# Altium project ControlBoard.PrjPcb (part 5 of 8)

## Sheet ResistiveTempSensors.SchDoc: Title
size A4; SchTemplateVer: V2.0; Author: Adam Mizerkiewicz; CompanyName: Adam Mizerkiewicz; DrawnBy: Adam Mizerkiewicz; Engineer: Adam Mizerkiewicz; Organization: Adam Mizerkiewicz; Address1: Sarnia 2/19; Address2: 61-058 Poznań; Revision: 0.0; SheetNumber: 8; SheetTotal: 17
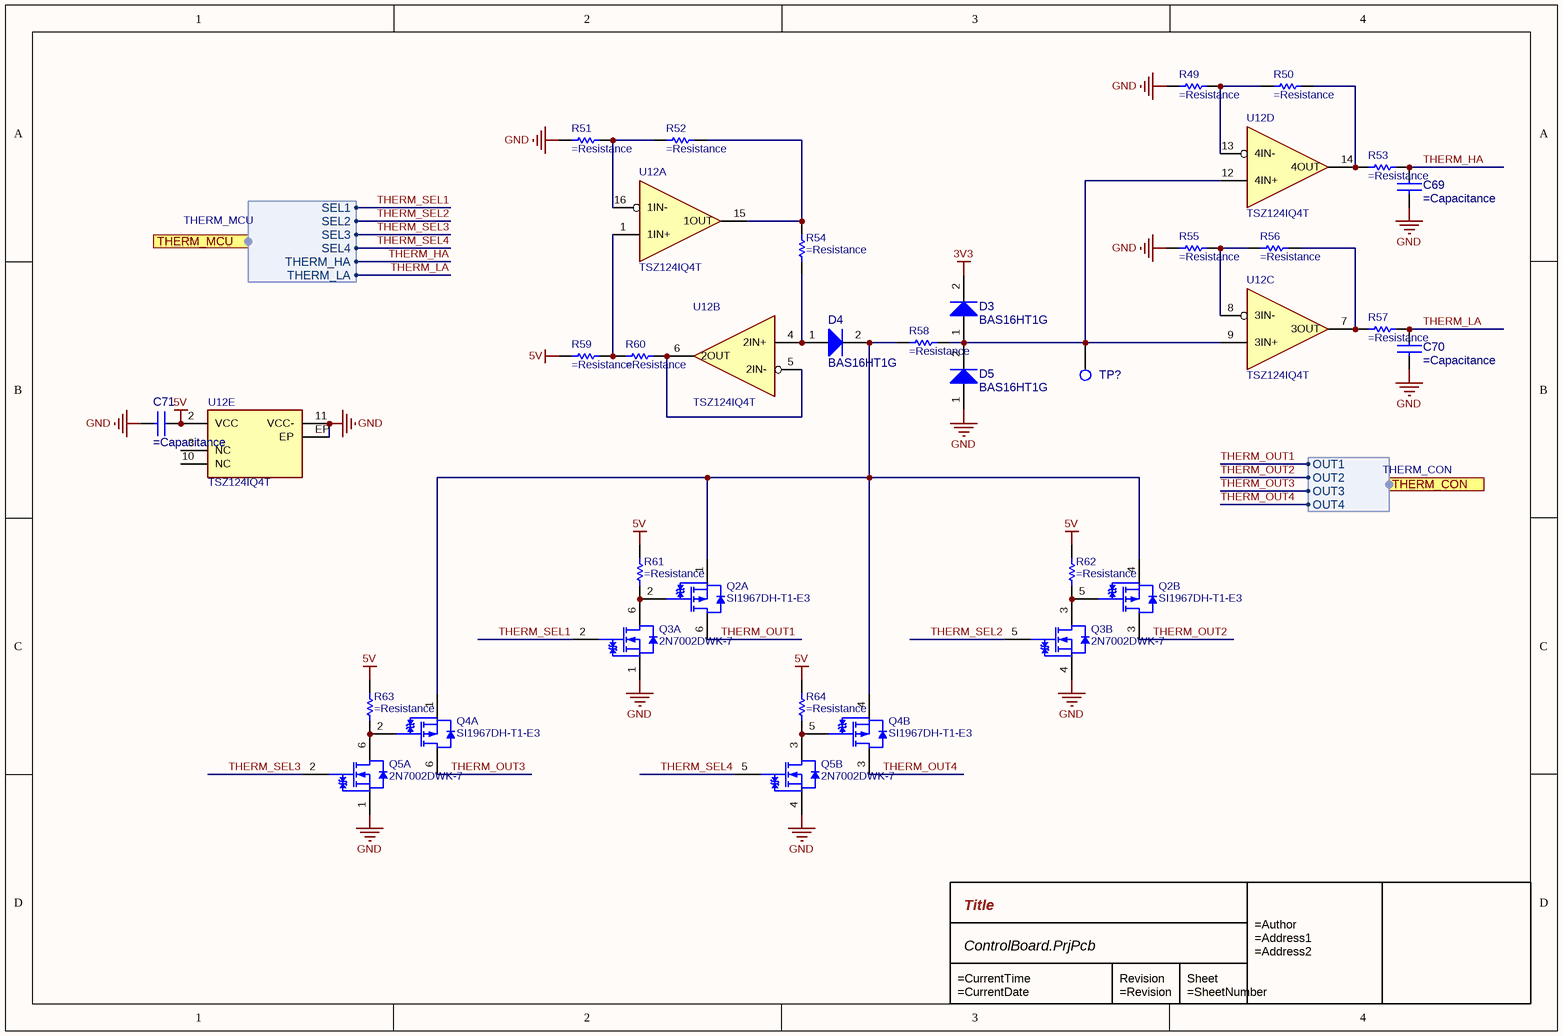
[diagram p12: ResistiveTempSensors.SchDoc]

### Parts
(Parts that share a designator on the sheet are numbered #1, #2 ... from top to bottom, then left to right.)
C69  (no value)  [C0402]
C70  (no value)  [C0402]
C71  (no value)  [C0402]
D3  BAS16HT1G  [SOD323]
D4  BAS16HT1G  [SOD323]
D5  BAS16HT1G  [SOD323]
Q2  SI1967DH-T1-E3  [SOT-363]  (parts A,B of 2)
Q3  2N7002DWK-7  [SOT-363]  (parts A,B of 2)
Q4  SI1967DH-T1-E3  [SOT-363]  (parts A,B of 2)
Q5  2N7002DWK-7  [SOT-363]  (parts A,B of 2)
R49  (no value)  [R0402]
R50  (no value)  [R0402]
R51  (no value)  [R0402]
R52  (no value)  [R0402]
R53  (no value)  [R0402]
R54  (no value)  [R0402]
R55  (no value)  [R0402]
R56  (no value)  [R0402]
R57  (no value)  [R0402]
R58  (no value)  [R0402]
R59  (no value)  [R0402]
R60  (no value)  [R0402]
R61  (no value)  [R0402]
R62  (no value)  [R0402]
R63  (no value)  [R0402]
R64  (no value)  [R0402]
TP?#7  TP_SMT  [TP_SMT]  (value not drawn)  (no BOM)
U12  TSZ124IQ4T  [VQFN16]  (parts A,B,C,D,E of 5)

### Ports
THERM_CON (harness THERM_CON), THERM_MCU (harness THERM_MCU)

### Harnesses
THERM_MCU: SEL1, SEL2, SEL3, SEL4, THERM_HA, THERM_LA
THERM_CON: OUT1, OUT2, OUT3, OUT4

### Nets
3V3: D3.2
5V: C71.1 R59.1 R61.2 R62.2 R63.2 R64.2 U12.2(VCC)
GND: C69.2 C70.2 C71.2 D5.1 Q3.1(S1) Q3.4(S2) Q5.1(S1) Q5.4(S2) R49.1 R51.1 R55.2 U12.11(VCC-) U12.EP
THERM_HA: C69.1 R53.1 ; port THERM_MCU.THERM_HA
THERM_LA: C70.1 R57.1 ; port THERM_MCU.THERM_LA
THERM_OUT1: Q2.6(D) ; port THERM_CON.OUT1
THERM_OUT2: Q2.3(D) ; port THERM_CON.OUT2
THERM_OUT3: Q4.6(D) ; port THERM_CON.OUT3
THERM_OUT4: Q4.3(D) ; port THERM_CON.OUT4
THERM_SEL1: Q3.2(G1) ; port THERM_MCU.SEL1
THERM_SEL2: Q3.5(G2) ; port THERM_MCU.SEL2
THERM_SEL3: Q5.2(G1) ; port THERM_MCU.SEL3
THERM_SEL4: Q5.5(G2) ; port THERM_MCU.SEL4
NetD3_1: D3.1 D5.2 R58.2 TP?#7.1 U12.9(3IN+) U12.12(4IN+)
NetD4_1: D4.1 R54.1 U12.4(2IN+)
NetD4_2: D4.2 Q2.1(S) Q2.4(S) Q4.1(S) Q4.4(S) R58.1
NetQ2_2: Q2.2(G) Q3.6(D1) R61.1
NetQ2_5: Q2.5(G) Q3.3(D2) R62.1
NetQ4_2: Q4.2(G) Q5.6(D1) R63.1
NetQ4_5: Q4.5(G) Q5.3(D2) R64.1
NetR49_2: R49.2 R50.2 U12.13(4IN-)
NetR50_1: R50.1 R53.2 U12.14(4OUT)
NetR51_2: R51.2 R52.1 U12.16(1IN-)
NetR52_2: R52.2 R54.2 U12.15(1OUT)
NetR55_1: R55.1 R56.2 U12.8(3IN-)
NetR56_1: R56.1 R57.2 U12.7(3OUT)
NetR59_2: R59.2 R60.1 U12.1(1IN+)
NetR60_2: R60.2 U12.5(2IN-) U12.6(2OUT)

Not connected (* = marked no-connect by the designer): U12 3(NC) 10(NC)

### Notes on the sheet
- Revision
  =Revision
- Sheet
  =SheetNumber / =SheetTotal

### Library data of the parts
C69-C71 = CAP0402-0.1uF-50V: CAP CER 0.1UF 50V X7R 0402; Manufacturer: Walsin Technologies; Manufacturer Part Number: 0402B104K500CT; Capacitance: 100nF; Material: 4241ConductorMaterial; Value: 100nF; Tolerance: 10%; Dielectric: 1511DielectricType; Supplier: Digikey; Supplier Part Number: 1292-1176-1-ND; RoHS: Yes; Category: Ceramic Capacitors; Stock: 109567; Pricing: 1=0,08, 10=0,005, 100=0,0032, 1000=0,0024 (USD); Mounting Technology: Surface Mount; Case/Package: 0402; Case Code (Imperial): 0402; Case Code (Metric): 1005; Min Operating Temperature: -55°C; Max Operating Temperature: 125°C; Packaging: Cut Tape; Voltage Rating: 50V; Series: -; Voltage Rating (DC): 50V; Height: 550um; RoHS Compliant: Yes; Lead Free: 5697LeadFree; ComponentLink1URL: http://datasheet.octopart.com/0402B104K500CT-Walsin-Technologies-datasheet-26371553.pdf?src-supplier=Arrow+Electronics; ComponentLink1Description: http://datasheet.octopart.com/0402B104K500CT-Walsin-Technologies-datasheet-26371553.pdf?src-supplier=Arrow+Electronics; ComponentLink2URL: http://datasheet.octopart.com/0402B104K500CT-Walsin-Technologies-datasheet-26371553.pdf?src-supplier=Verical; ComponentLink2Description: http://datasheet.octopart.com/0402B104K500CT-Walsin-Technologies-datasheet-26371553.pdf?src-supplier=Verical; ComponentLink3URL: http://www.passivecomponent.com/indexsea/0402B104K500CT-IE.pdf?src-supplier=Digikey; ComponentLink3Description: http://www.passivecomponent.com/indexsea/0402B104K500CT-IE.pdf?src-supplier=Digikey; ComponentLink4URL: http://datasheet.octopart.com/0402B104K500CT-Walsin-Technologies-datasheet-26371553.pdf?src-supplier=Rs; ComponentLink4Description: http://datasheet.octopart.com/0402B104K500CT-Walsin-Technologies-datasheet-26371553.pdf?src-supplier=Rs; ComponentLink5URL: https://datasheet.octopart.com/0402B104K500CT-Walsin-Technologies-datasheet-128065749.pdf?src-supplier=Future+Electronics; ComponentLink5Description: https://datasheet.octopart.com/0402B104K500CT-Walsin-Technologies-datasheet-128065749.pdf?src-supplier=Future+Electronics; ComponentLink6URL: http://datasheet.octopart.com/0402B104K500CT-Walsin-Technologies-datasheet-26371553.pdf?src-supplier=Farnell; ComponentLink6Description: http://datasheet.octopart.com/0402B104K500CT-Walsin-Technologies-datasheet-26371553.pdf?src-supplier=Farnell; ComponentLink7URL: http://datasheet.octopart.com/0402B104K500CT-Walsin-Technologies-datasheet-26371553.pdf?src-supplier=Newark; ComponentLink7Description: http://datasheet.octopart.com/0402B104K500CT-Walsin-Technologies-datasheet-26371553.pdf?src-supplier=Newark; ComponentLink8URL: http://datasheet.octopart.com/0402B104K500CT-Walsin-Technologies-datasheet-26371553.pdf?src-supplier=Mouser; ComponentLink8Description: http://datasheet.octopart.com/0402B104K500CT-Walsin-Technologies-datasheet-26371553.pdf?src-supplier=Mouser; ComponentLink9URL: http://datasheet.octopart.com/0402B104K500CT-Walsin-Technologies-datasheet-26371553.pdf?src-supplier=Digikey; ComponentLink9Description: http://datasheet.octopart.com/0402B104K500CT-Walsin-Technologies-datasheet-26371553.pdf?src-supplier=Digikey; ComponentLink10URL: https://datasheet.octopart.com/0402B104K500CT-Walsin-Technologies-datasheet-62066062.pdf?src-supplier=TME; ComponentLink10Description: https://datasheet.octopart.com/0402B104K500CT-Walsin-Technologies-datasheet-62066062.pdf?src-supplier=TME; ComponentLink11URL: http://datasheet.octopart.com/0402B104K500CT-Walsin-Technologies-datasheet-26371553.pdf?src-supplier=Freelance+Electronics; ComponentLink11Description: http://datasheet.octopart.com/0402B104K500CT-Walsin-Technologies-datasheet-26371553.pdf?src-supplier=Freelance+Electronics; ComponentLink12URL: http://datasheet.octopart.com/0402B104K500CT-Walsin-Technologies-datasheet-26371553.pdf?src-supplier=Component+Sense; ComponentLink12Description: http://datasheet.octopart.com/0402B104K500CT-Walsin-Technologies-datasheet-26371553.pdf?src-supplier=Component+Sense; ComponentLink13URL: http://datasheet.octopart.com/0402B104K500CT-Walsin-Technologies-datasheet-26371553.pdf?src-supplier=NAC+Semi; ComponentLink13Description: http://datasheet.octopart.com/0402B104K500CT-Walsin-Technologies-datasheet-26371553.pdf?src-supplier=NAC+Semi; ComponentLink14URL: https://datasheet.octopart.com/0402B104K500CT-Walsin-Technologies-datasheet-136037192.pdf?src-supplier=TECHDesign; ComponentLink14Description: https://datasheet.octopart.com/0402B104K500CT-Walsin-Technologies-datasheet-136037192.pdf?src-supplier=TECHDesign; Supplier 1: Digikey; Supplier Part Number 1: 1292-1176-1-ND
D3-D5 = BAS16H: Diode, Rectifier, Switching, Vr 75VDC, If 200MA, Pkg SOD-323, Vf 1250MV, Trr 6NS, Cj 2PF; Manufacturer: onsemi; Manufacturer Lifecycle Status: ACTIVE; Breakdown Voltage: 75V; Element Configuration: Single; Forward Voltage: 715mV; Max Forward Surge Current (Ifsm): 500mA; Max Power Dissipation: 200mW; Max Repetitive Reverse Voltage (Vrrm): 85V; Max Reverse Leakage Current: 1µA; Max Reverse Voltage (DC): 100V; Max Surge Current: 600mA; Number of Elements: 1; Polarity: Standard; Supplier 1: DigiKey; Supplier Part Number 1: BAS16HT1GOSCT-ND; Supplier: DigiKey; Supplier Part Number: BAS16HT1GOSCT-ND; Manufacturer Part Number: BAS16HT1G; RoHS: Compliant; Category: Rectifier Diodes; Stock: 518468; Pricing: 1=0,1, 10=0,049, 100=0,0422, 500=0,03042, 1000=0,02655 (USD); Average Rectified Current: 200mA; Value: 2pF; China RoHS: Compliant; Contact Plating: Tin; Current Rating: 200mA; Forward Current: 200mA; Height: 900µm; Lead Free: Lead Free; Length: 1.7mm; Lifecycle Status: Production; Max Operating Temperature: 150°C; Max Output current: 200mA; Min Operating Temperature: -55°C; Mounting Technology: Surface Mount; Pins: 2; Number of Terminals: 2; Output Current: 200mA; Packaging: Tape and Reel; Peak Non-Repetitive Surge Current: 600mA; Peak Reverse Current: 1µA; Power Dissipation: 200mW; Radiation Hardening: No; REACH SVHC: No; Recovery Time: 6ns; Reverse Recovery Time: 6ns; Reverse Standoff Voltage: 85V; Reverse Voltage: 85V; Schedule B: 8541100070, 8541100070|8541100070|8541100070|8541100070|8541100070; Voltage Rating (DC): 75V; Weight: 33mg; Width: 1.25mm; ComponentLink1URL: https://datasheet.octopart.com:443/BAS16HT1G-ON-Semiconductor-datasheet-115937.pdf?src-supplier=element14+APAC; ComponentLink1Description: https://datasheet.octopart.com:443/BAS16HT1G-ON-Semiconductor-datasheet-115937.pdf?src-supplier=element14+APAC; ComponentLink2URL: https://datasheet.octopart.com:443/BAS16HT1G-ON-Semiconductor-datasheet-67293425.pdf?src-supplier=element14+APAC; ComponentLink2Description: https://datasheet.octopart.com:443/BAS16HT1G-ON-Semiconductor-datasheet-67293425.pdf?src-supplier=element14+APAC; ComponentLink3URL: https://datasheet.octopart.com:443/BAS16HT1G-ON-Semiconductor-datasheet-86781274.pdf?src-supplier=element14+APAC; ComponentLink3Description: https://datasheet.octopart.com:443/BAS16HT1G-ON-Semiconductor-datasheet-86781274.pdf?src-supplier=element14+APAC; ComponentLink4URL: https://datasheet.octopart.com:443/BAS16HT1G-onsemi-datasheet-180957826.pdf?src-supplier=IHS; ComponentLink4Description: https://datasheet.octopart.com:443/BAS16HT1G-onsemi-datasheet-180957826.pdf?src-supplier=IHS; ComponentLink5URL: https://datasheet.octopart.com:443/BAS16HT1G-ON-Semiconductor-datasheet-30892817.pdf?src-supplier=IHS; ComponentLink5Description: https://datasheet.octopart.com:443/BAS16HT1G-ON-Semiconductor-datasheet-30892817.pdf?src-supplier=IHS; ComponentLink6URL: https://datasheet.octopart.com:443/BAS16HT1G-ON-Semiconductor-datasheet-33006779.pdf?src-supplier=Upverter; ComponentLink6Description: https://datasheet.octopart.com:443/BAS16HT1G-ON-Semiconductor-datasheet-33006779.pdf?src-supplier=Upverter; ComponentLink7URL: https://datasheet.octopart.com:443/BAS16HT1G-ON-Semiconductor-datasheet-137916682.pdf?src-supplier=onsemi; ComponentLink7Description: https://datasheet.octopart.com:443/BAS16HT1G-ON-Semiconductor-datasheet-137916682.pdf?src-supplier=onsemi; ComponentLink8URL: https://datasheet.octopart.com:443/BAS16HT1G-ON-Semiconductor-datasheet-86688369.pdf?src-supplier=onsemi; ComponentLink8Description: https://datasheet.octopart.com:443/BAS16HT1G-ON-Semiconductor-datasheet-86688369.pdf?src-supplier=onsemi; ComponentLink9URL: https://datasheet.octopart.com:443/BAS16HT1G-onsemi-datasheet-181958668.pdf?src-supplier=Newark; ComponentLink9Description: https://datasheet.octopart.com:443/BAS16HT1G-onsemi-datasheet-181958668.pdf?src-supplier=Newark; ComponentLink10URL: https://datasheet.octopart.com:443/BAS16HT1G-Fairchild-Semiconductor-datasheet-67878755.pdf?src-supplier=Newark; ComponentLink10Description: https://datasheet.octopart.com:443/BAS16HT1G-Fairchild-Semiconductor-datasheet-67878755.pdf?src-supplier=Newark; ComponentLink11URL: https://datasheet.octopart.com:443/BAS16HT1G-Fairchild-Semiconductor-datasheet-67809726.pdf?src-supplier=Newark; ComponentLink11Description: https://datasheet.octopart.com:443/BAS16HT1G-Fairchild-Semiconductor-datasheet-67809726.pdf?src-supplier=Newark; ComponentLink12URL: https://datasheet.octopart.com:443/BAS16HT1G-Fairchild-Semiconductor-datasheet-68558646.pdf?src-supplier=Newark; ComponentLink12Description: https://datasheet.octopart.com:443/BAS16HT1G-Fairchild-Semiconductor-datasheet-68558646.pdf?src-supplier=Newark; ComponentLink13URL: https://datasheet.octopart.com:443/BAS16HT1G-Fairchild-Semiconductor-datasheet-5362264.pdf?src-supplier=Fairchild+Semiconductor; ComponentLink13Description: https://datasheet.octopart.com:443/BAS16HT1G-Fairchild-Semiconductor-datasheet-5362264.pdf?src-supplier=Fairchild+Semiconductor; ComponentLink14URL: https://sigma.octopart.com:443/17344476/technical_drawing/Fairchild-Semiconductor-BAS16HT1G.pdf?src-supplier=Fairchild+Semiconductor; ComponentLink14Description: https://sigma.octopart.com:443/17344476/technical_drawing/Fairchild-Semiconductor-BAS16HT1G.pdf?src-supplier=Fairchild+Semiconductor; ComponentLink15URL: https://datasheet.octopart.com:443/BAS16HT1G-onsemi-datasheet-21771981.pdf?src-supplier=Master+Electronics; ComponentLink15Description: https://datasheet.octopart.com:443/BAS16HT1G-onsemi-datasheet-21771981.pdf?src-supplier=Master+Electronics; ComponentLink16URL: https://datasheet.octopart.com:443/BAS16HT1G-ON-Semiconductor-datasheet-17590349.pdf?src-supplier=TME; ComponentLink16Description: https://datasheet.octopart.com:443/BAS16HT1G-ON-Semiconductor-datasheet-17590349.pdf?src-supplier=TME; ComponentLink17URL: https://datasheet.octopart.com:443/BAS16HT1G-ON-Semiconductor-datasheet-14053657.pdf?src-supplier=iiiC; ComponentLink17Description: https://datasheet.octopart.com:443/BAS16HT1G-ON-Semiconductor-datasheet-14053657.pdf?src-supplier=iiiC; ComponentLink18URL: https://datasheet.octopart.com:443/BAS16HT1G-ON-Semiconductor-datasheet-9788525.pdf?src-supplier=RS+(Formerly+Allied+Electronics); ComponentLink18Description: https://datasheet.octopart.com:443/BAS16HT1G-ON-Semiconductor-datasheet-9788525.pdf?src-supplier=RS+(Formerly+Allied+Electronics); ComponentLink19URL: https://datasheet.octopart.com:443/BAS16HT1G-ON-Semiconductor-datasheet-8443271.pdf?src-supplier=Jameco; ComponentLink19Description: https://datasheet.octopart.com:443/BAS16HT1G-ON-Semiconductor-datasheet-8443271.pdf?src-supplier=Jameco; ComponentLink20URL: https://datasheet.octopart.com:443/BAS16HT1G-Fairchild-Semiconductor-datasheet-68652414.pdf?src-supplier=Farnell; ComponentLink20Description: https://datasheet.octopart.com:443/BAS16HT1G-Fairchild-Semiconductor-datasheet-68652414.pdf?src-supplier=Farnell; ComponentLink21URL: https://datasheet.octopart.com:443/BAS16HT1G-Fairchild-Semiconductor-datasheet-78857374.pdf?src-supplier=Farnell; ComponentLink21Description: https://datasheet.octopart.com:443/BAS16HT1G-Fairchild-Semiconductor-datasheet-78857374.pdf?src-supplier=Farnell; ComponentLink22URL: http://sigma.octopart.com:80/15540786/rohs_certificate/ON-Semiconductor-BAS16HT1G.pdf?src-supplier=Compliance+Statements; ComponentLink22Description: http://sigma.octopart.com:80/15540786/rohs_certificate/ON-Semiconductor-BAS16HT1G.pdf?src-supplier=Compliance+Statements; ComponentLink23URL: http://sigma.octopart.com:80/15674185/materials_sheet/ON-Semiconductor-BAS16HT1G.csv?src-supplier=Compliance+Statements; ComponentLink23Description: http://sigma.octopart.com:80/15674185/materials_sheet/ON-Semiconductor-BAS16HT1G.csv?src-supplier=Compliance+Statements; ComponentLink24URL: http://sigma.octopart.com:80/150603887/rohs_statement/ON-Semiconductor-BAS16HT1G.pdf?src-supplier=Compliance+Statements; ComponentLink24Description: http://sigma.octopart.com:80/150603887/rohs_statement/ON-Semiconductor-BAS16HT1G.pdf?src-supplier=Compliance+Statements; ComponentLink25URL: http://sigma.octopart.com:80/17344474/reach_statement/Fairchild-Semiconductor-BAS16HT1G.pdf?src-supplier=Compliance+Statements; ComponentLink25Description: http://sigma.octopart.com:80/17344474/reach_statement/Fairchild-Semiconductor-BAS16HT1G.pdf?src-supplier=Compliance+Statements; ComponentLink26URL: http://sigma.octopart.com:80/17344475/materials_sheet/Fairchild-Semiconductor-BAS16HT1G.pdf?src-supplier=Compliance+Statements; ComponentLink26Description: http://sigma.octopart.com:80/17344475/materials_sheet/Fairchild-Semiconductor-BAS16HT1G.pdf?src-supplier=Compliance+Statements; ComponentLink27URL: http://sigma.octopart.com:80/33049500/reach_statement/Fairchild-Semiconductor-BAS16HT1G.pdf?src-supplier=Compliance+Statements; ComponentLink27Description: http://sigma.octopart.com:80/33049500/reach_statement/Fairchild-Semiconductor-BAS16HT1G.pdf?src-supplier=Compliance+Statements; ComponentLink28URL: http://sigma.octopart.com:80/33049507/materials_sheet/Fairchild-Semiconductor-BAS16HT1G.pdf?src-supplier=Compliance+Statements; ComponentLink28Description: http://sigma.octopart.com:80/33049507/materials_sheet/Fairchild-Semiconductor-BAS16HT1G.pdf?src-supplier=Compliance+Statements; ComponentLink29URL: http://sigma.octopart.com:80/reach_statement/ON-Semiconductor-company-79.pdf?src-supplier=Compliance+Statements; ComponentLink29Description: http://sigma.octopart.com:80/reach_statement/ON-Semiconductor-company-79.pdf?src-supplier=Compliance+Statements; ComponentLink30URL: http://sigma.octopart.com:80/reach_statement/Fairchild-Semiconductor-company-9.pdf?src-supplier=Compliance+Statements; ComponentLink30Description: http://sigma.octopart.com:80/reach_statement/Fairchild-Semiconductor-company-9.pdf?src-supplier=Compliance+Statements; ComponentLink31URL: http://sigma.octopart.com:80/rohs_statement/Fairchild-Semiconductor-company-10.pdf?src-supplier=Compliance+Statements; ComponentLink31Description: http://sigma.octopart.com:80/rohs_statement/Fairchild-Semiconductor-company-10.pdf?src-supplier=Compliance+Statements; ComponentLink32URL: http://sigma.octopart.com:80/rohs_statement/Fairchild-Semiconductor-company-11.pdf?src-supplier=Compliance+Statements; ComponentLink32Description: http://sigma.octopart.com:80/rohs_statement/Fairchild-Semiconductor-company-11.pdf?src-supplier=Compliance+Statements; ComponentLink33URL: https://octopart.com:443/opatz8j6/c1?t=3sa6m3SxYoge9M9qGb4nmKLqBfrMfXhiJOp9hKZyxrh3ehL_BI6LOToHUMMaKyKket4Z1sj90yfHaTytxDd4kTrDgXQ_hpbHeYPETYjP_WAA8e26rBtBfn1_I3ReRiAJKkCOBeYfrSkepAVHT7WZ6faBb9xXyATk-AGWAiJUyc-olZRBf61e2PglA_o6oH6j0ZhWcjIMQr1OaZAsEemOypn9rSngJhyD2Q95BhY21uejmtdLxB3PfquCAALl-V8d6PzywhadjY_2sOYX1IRBN1ePsZlil2tKA3QQi1fpa_2NXZPSYNF3QM8W_-CjkL6rbjh6IOEZ1PtqSUWglJ_mpLUY0n0_jcKHQN0&src-supplier=Compliance+Statements; ComponentLink33Description: https://octopart.com:443/opatz8j6/c1?t=3sa6m3SxYoge9M9qGb4nmKLqBfrMfXhiJOp9hKZyxrh3ehL_BI6LOToHUMMaKyKket4Z1sj90yfHaTytxDd4kTrDgXQ_hpbHeYPETYjP_WAA8e26rBtBfn1_I3ReRiAJKkCOBeYfrSkepAVHT7WZ6faBb9xXyATk-AGWAiJUyc-olZRBf61e2PglA_o6oH6j0ZhWcjIMQr1OaZAsEemOypn9rSngJhyD2Q95BhY21uejmtdLxB3PfquCAALl-V8d6PzywhadjY_2sOYX1IRBN1ePsZlil2tKA3QQi1fpa_2NXZPSYNF3QM8W_-CjkL6rbjh6IOEZ1PtqSUWglJ_mpLUY0n0_jcKHQN0&src-supplier=Compliance+Statements; ComponentLink34URL: https://octopart.com:443/opatz8j6/c1?t=BeFj0GxZ0-VbTF2PfXHp6AnktMjJ4eXiHVy6Fo2zviSPGKYfBUukSRk8rDGnUJcdwRnP-ck7I8FMZezNYJ_1dK-dO54YBllHyBY0SnmYOKk1p3exRmhljXa6F2Bpgkcpr13sfMJDmDHTvXk40ahuM8IGb89TNn7vkLTl85aZ0H7gci15r64hfA7LHtbGW7rg3VX_V3sXUHsPHwOLj-ZkG6CcHSAMpHRU5QV5habCtdOmhiw0JT4yp_gLtU2Jo7wuRm4gw6v2ip48IG5kBRN8SehbmPIFgmt3ZxmeBnsXKDdBqXiqR7ew8NtlDUgnfFMGU43dhWEbA7nmL_UII0preXOLm51me80stQ&src-supplier=Compliance+Statements; ComponentLink34Description: https://octopart.com:443/opatz8j6/c1?t=BeFj0GxZ0-VbTF2PfXHp6AnktMjJ4eXiHVy6Fo2zviSPGKYfBUukSRk8rDGnUJcdwRnP-ck7I8FMZezNYJ_1dK-dO54YBllHyBY0SnmYOKk1p3exRmhljXa6F2Bpgkcpr13sfMJDmDHTvXk40ahuM8IGb89TNn7vkLTl85aZ0H7gci15r64hfA7LHtbGW7rg3VX_V3sXUHsPHwOLj-ZkG6CcHSAMpHRU5QV5habCtdOmhiw0JT4yp_gLtU2Jo7wuRm4gw6v2ip48IG5kBRN8SehbmPIFgmt3ZxmeBnsXKDdBqXiqR7ew8NtlDUgnfFMGU43dhWEbA7nmL_UII0preXOLm51me80stQ&src-supplier=Compliance+Statements
Q2 Q4 = SI1967DH-T1-E3: MOSFET 2P-CH 20V 1.3A SC70-6; Manufacturer: Vishay Siliconix; Rise Time: 27ns; Rds On Max: 490mR; Input Capacitance: 110pF; Gate to Source Voltage (Vgs): 8V; Max Power Dissipation: 1.25W; Turn-Off Delay Time: 15ns; Turn-On Delay Time: 12ns; Number of Channels: 2; Polarity: P-CHANNEL; Supplier 1: Digikey; Supplier Part Number 1: SI1967DH-T1-E3CT-ND; Supplier: Digikey; Supplier Part Number: SI1967DH-T1-E3CT-ND; Manufacturer Part Number: SI1967DH-T1-E3; RoHS: No; Category: MOSFETs; Stock: 6717; Pricing: 1=0,66, 10=0,409, 100=0,2622, 500=0,19876, 1000=0,16922 (USD); Mounting Technology: Surface Mount; Weight: 0.000988oz; Min Operating Temperature: -55°C; Max Operating Temperature: 150°C; Packaging: Tape and Reel; Package Quantity: 3000; Continuous Drain Current (ID): 1.3A; Drain to Source Resistance: 490mR; Fall Time: 27ns; Drain to Source Voltage (Vdss): 20V; Series: TrenchFET®; Length: 2mm; Width: 1.25mm; Height: 1mm; Radiation Hardening: No; Lead Free: Lead Free; RoHS Compliant: Yes; ComponentLink1URL: https://datasheet.ciiva.com/930/si1967dh-930084.pdf?src-supplier=Digikey; ComponentLink1Description: https://datasheet.ciiva.com/930/si1967dh-930084.pdf?src-supplier=Digikey; ComponentLink2URL: https://datasheet.ciiva.com/11161/si1967dh-11161099.pdf?src-supplier=Avnet; ComponentLink2Description: https://datasheet.ciiva.com/11161/si1967dh-11161099.pdf?src-supplier=Avnet
Q3 Q5 = 2N7002DWK-7: MOSFET 2N-CH 60V 0.261A SOT363; Manufacturer: Diodes; Supplier: Digikey; Supplier Part Number: 31-2N7002DWK-7CT-ND; Manufacturer Part Number: 2N7002DWK-7; RoHS: No; Category: Uncategorized; Stock: 2664; Pricing: 1=0,21, 10=0,142, 100=0,0931, 500=0,07452, 1000=0,06584 (USD); Supplier 1: Digikey; Supplier Part Number 1: 31-2N7002DWK-7CT-ND
R49 = RES0402-1k-1%: Res Thick Film 0402 1K Ohm 1% 0.063W(1/16W) ±50ppm/C Pad SMD Automotive T/R; Manufacturer: Vishay; Manufacturer Part Number: CRCW04021K00FHEDP; Resistance: 1kΩ; Max Power Dissipation: 63mW; Value: 1kΩ; Temperature Coefficient: 50ppm/°C; Voltage Rating: 50V; Supplier 1: DigiKey; Supplier Part Number 1: CRCW04021K00FHEDP-ND; Supplier: DigiKey; Supplier Part Number: CRCW04021K00FHEDP-ND; RoHS: Compliant; Category: Chip SMD Resistors; Pricing: 10000=0,03252 (USD); Case/Package: 0402; China RoHS: Non-Compliant; Composition: Thick Film; Contact Plating: Tin; Depth: 500µm; Features: Automotive AEC-Q200; Height: 350µm; Length: 990.6µm; Lifecycle Status: Production; Max Operating Temperature: 155°C; Military Standard: Not; Min Operating Temperature: -55°C; Mounting Technology: Surface Mount; Number of Terminals: 2; Number of Terminations: 2; Packaging: Tape & Reel; Power Dissipation: 63mW; Power Rating: 63mW; Radiation Hardening: No; REACH SVHC: Yes; Tolerance: 1%; Width: 500µm; Working Voltage: 50V; ComponentLink1URL: https://datasheet.octopart.com:443/CRCW04021K00FHEDP-Vishay-datasheet-182027415.pdf?src-supplier=IHS; ComponentLink1Description: https://datasheet.octopart.com:443/CRCW04021K00FHEDP-Vishay-datasheet-182027415.pdf?src-supplier=IHS; ComponentLink2URL: https://datasheet.octopart.com:443/CRCW04021K00FHEDP-Vishay-Dale-datasheet-141207190.pdf?src-supplier=Upverter; ComponentLink2Description: https://datasheet.octopart.com:443/CRCW04021K00FHEDP-Vishay-Dale-datasheet-141207190.pdf?src-supplier=Upverter; ComponentLink3URL: http://sigma.octopart.com:80/rohs_statement/Vishay-company-15.pdf?src-supplier=Compliance+Statements; ComponentLink3Description: http://sigma.octopart.com:80/rohs_statement/Vishay-company-15.pdf?src-supplier=Compliance+Statements
R50 R52-R57 R60-R64 = RES0402-10k-1%: Res Thick Film 0402 10K Ohm 1% 0.063W(1/16W) ±100ppm/C Pad SMD T/R Automotive AEC-Q200; Manufacturer: Vishay; Manufacturer Part Number: CRCW040210K0FKEE; Resistance: 10kΩ; Max Power Dissipation: 63mW; Value: 10kΩ; Temperature Coefficient: 100ppm/°C; Voltage Rating: 50V; Supplier 1: DigiKey; Supplier Part Number 1: 541-2954-1-ND; Supplier: DigiKey; Supplier Part Number: 541-2954-1-ND; RoHS: Compliant; Category: Chip SMD Resistors; Pricing: 1=0,1, 10=0,03, 25=0,0224, 50=0,018, 100=0,0148, 250=0,01156, 500=0,00974, 1000=0,00832, 5000=0,00637 (USD); Case/Package: 0402; Case Code (Imperial): 0402; Case Code (Metric): 1005; China RoHS: Non-Compliant; Composition: Thick Film; Contact Plating: Tin; Depth: 500µm; Features: Automotive AEC-Q200; Height: 350µm; Lead Free: Lead Free; Length: 990.6µm; Lifecycle Status: Production; Max Operating Temperature: 155°C; Military Standard: Not; Min Operating Temperature: -55°C; Mounting Technology: Surface Mount; Number of Terminals: 2; Number of Terminations: 2; Packaging: Tape & Reel; Power Dissipation: 63mW; Power Rating: 63mW; Radiation Hardening: No; REACH SVHC: Yes; Schedule B: 8533210045, 8533210045|8533210045|8533210045|8533210045|8533210045|8533210045|8533210045|8533210045|8533210045|8533210045|8533210045|8533210045|8533210045|8533210045|8533210045|8533210045|8533210045|8533210045|8533210045|8533210045|8533210045|8533210045|8533210045|85; Tolerance: 1%; Voltage Rating (DC): 50V; Width: 500µm; Working Voltage: 50V; ComponentLink1URL: https://datasheet.octopart.com:443/CRCW040210K0FKEE-Vishay-datasheet-175423584.pdf?src-supplier=IHS; ComponentLink1Description: https://datasheet.octopart.com:443/CRCW040210K0FKEE-Vishay-datasheet-175423584.pdf?src-supplier=IHS; ComponentLink2URL: https://datasheet.octopart.com:443/CRCW040210K0FKEE-Vishay-datasheet-62316122.pdf?src-supplier=Future+Electronics; ComponentLink2Description: https://datasheet.octopart.com:443/CRCW040210K0FKEE-Vishay-datasheet-62316122.pdf?src-supplier=Future+Electronics; ComponentLink3URL: http://sigma.octopart.com:80/rohs_statement/Vishay-company-15.pdf?src-supplier=Compliance+Statements; ComponentLink3Description: http://sigma.octopart.com:80/rohs_statement/Vishay-company-15.pdf?src-supplier=Compliance+Statements
R51 R59 = RES0402-2k-1%: Res Thick Film 0402 2K Ohm 1% 1/16W 100ppm/C Molded SMD SMD Paper T/R; Manufacturer: Vishay; Manufacturer Part Number: CRCW04022K00FKEE; Resistance: 2kΩ; Max Power Dissipation: 63mW; Value: 2kΩ; Temperature Coefficient: 100ppm/°C; Voltage Rating: 50V; Supplier 1: DigiKey; Supplier Part Number 1: 541-CRCW04022K00FKEECT-ND; Supplier: DigiKey; Supplier Part Number: 541-CRCW04022K00FKEECT-ND; RoHS: Compliant; Category: Chip SMD Resistors; Stock: 10445; Pricing: 1=0,1, 10=0,03, 25=0,0224, 50=0,018, 100=0,0148, 250=0,01156, 500=0,01056, 1000=0,0084, 5000=0,00637 (USD); Case/Package: 0402; China RoHS: Non-Compliant; Composition: Thick Film; Contact Plating: Tin; Features: Automotive AEC-Q200; Height: 350µm; Lead Free: Lead Free; Length: 990.6µm; Lifecycle Status: Production; Max Operating Temperature: 155°C; Min Operating Temperature: -55°C; Mounting Technology: Surface Mount; Number of Terminals: 2; Number of Terminations: 2; Packaging: Tape & Reel; Power Dissipation: 63mW; Power Rating: 63mW; Radiation Hardening: No; REACH SVHC: Yes; Tolerance: 1%; Width: 500µm; Working Voltage: 50V; ComponentLink1URL: https://datasheet.octopart.com:443/CRCW04022K00FKEE-Vishay-datasheet-175423584.pdf?src-supplier=IHS; ComponentLink1Description: https://datasheet.octopart.com:443/CRCW04022K00FKEE-Vishay-datasheet-175423584.pdf?src-supplier=IHS; ComponentLink2URL: https://datasheet.octopart.com/D-CRCW-e3-Standard-Thick-Film-Chip-Resistors-Vishay-datasheet-family-64.pdf; ComponentLink2Description: https://datasheet.octopart.com/D-CRCW-e3-Standard-Thick-Film-Chip-Resistors-Vishay-datasheet-family-64.pdf; ComponentLink3URL: http://sigma.octopart.com:80/rohs_certificate/D-CRCW-e3-Standard-Thick-Film-Chip-Resistors-Vishay-family-102.pdf?src-supplier=Compliance+Statements; ComponentLink3Description: http://sigma.octopart.com:80/rohs_certificate/D-CRCW-e3-Standard-Thick-Film-Chip-Resistors-Vishay-family-102.pdf?src-supplier=Compliance+Statements
R58 = RES0402-100k-1%: Res Thick Film 0402 100K Ohm 1% 0.063W(1/16W) ±100ppm/C Molded SMD Automotive Paper T/R; Manufacturer: Vishay; Manufacturer Part Number: CRCW0402100KFKEE; Resistance: 100kΩ; Max Power Dissipation: 63mW; Value: 100kΩ; Temperature Coefficient: 100ppm/°C; Voltage Rating: 50V; Supplier 1: DigiKey; Supplier Part Number 1: 541-CRCW0402100KFKEECT-ND; Supplier: DigiKey; Supplier Part Number: 541-CRCW0402100KFKEECT-ND; RoHS: Compliant; Category: Chip SMD Resistors; Stock: 14497; Pricing: 1=0,1, 10=0,03, 25=0,0224, 50=0,018, 100=0,0148, 250=0,01156, 500=0,00974, 1000=0,00832, 5000=0,00606 (USD); Case/Package: 0402; China RoHS: Non-Compliant; Composition: Thick Film; Contact Plating: Tin; Depth: 500µm; Features: Automotive AEC-Q200; Height: 350µm; Lead Free: Lead Free; Length: 990.6µm; Lifecycle Status: Production; Max Operating Temperature: 155°C; Military Standard: Not; Min Operating Temperature: -55°C; Mounting Technology: Surface Mount; Number of Terminals: 2; Number of Terminations: 2; Packaging: Tape & Reel; Power Dissipation: 63mW; Power Rating: 63mW; Radiation Hardening: No; REACH SVHC: Yes; Schedule B: 8533210045, 8533210045|8533210045|8533210045|8533210045|8533210045|8533210045|8533210045|8533210045|8533210045|8533210045|8533210045|8533210045|8533210045|8533210045|8533210045|8533210045|8533210045|8533210045|8533210045|8533210045|8533210045|8533210045|8533210045|85; Tolerance: 1%; Voltage Rating (DC): 50V; Width: 500µm; Working Voltage: 50V; ComponentLink1URL: https://datasheet.octopart.com:443/CRCW0402100KFKEE-Vishay-datasheet-175423584.pdf?src-supplier=IHS; ComponentLink1Description: https://datasheet.octopart.com:443/CRCW0402100KFKEE-Vishay-datasheet-175423584.pdf?src-supplier=IHS; ComponentLink2URL: https://datasheet.octopart.com:443/CRCW0402100KFKEE-Vishay-datasheet-190005712.pdf?src-supplier=TME; ComponentLink2Description: https://datasheet.octopart.com:443/CRCW0402100KFKEE-Vishay-datasheet-190005712.pdf?src-supplier=TME; ComponentLink3URL: https://datasheet.octopart.com:443/CRCW0402100KFKEE-Vishay-datasheet-62316122.pdf?src-supplier=Future+Electronics; ComponentLink3Description: https://datasheet.octopart.com:443/CRCW0402100KFKEE-Vishay-datasheet-62316122.pdf?src-supplier=Future+Electronics; ComponentLink4URL: https://datasheet.octopart.com/D-CRCW-e3-Standard-Thick-Film-Chip-Resistors-Vishay-datasheet-family-64.pdf; ComponentLink4Description: https://datasheet.octopart.com/D-CRCW-e3-Standard-Thick-Film-Chip-Resistors-Vishay-datasheet-family-64.pdf; ComponentLink5URL: http://sigma.octopart.com:80/rohs_certificate/D-CRCW-e3-Standard-Thick-Film-Chip-Resistors-Vishay-family-102.pdf?src-supplier=Compliance+Statements; ComponentLink5Description: http://sigma.octopart.com:80/rohs_certificate/D-CRCW-e3-Standard-Thick-Film-Chip-Resistors-Vishay-family-102.pdf?src-supplier=Compliance+Statements
TP?#7 = TP: TEST POINT
U12 = TSZ124IQ4T: TSZ124 Series 5.5V 400 kHz Rail to Rail SMT Operational Amplifier - TSSOP-14; Manufacturer: STMicroelectronics; Bandwidth: 400kHz; Common Mode Rejection Ratio: 115dB; Input Bias Current: 200pA; Input Offset Voltage (Vos): 8µV; Max Supply Current: 40µA; Max Supply Voltage: 6V; Min Supply Voltage: 1.8V; Nominal Supply Current: 31µA; Number of Channels: 4; Operating Supply Voltage: 3.3V; Output Current: 17mA; Output Current per Channel: 18mA; Slew Rate: 0.19V/µs; Voltage Gain: 135dB; Supplier 1: DigiKey; Supplier Part Number 1: 497-14337-1-ND; Supplier: DigiKey; Supplier Part Number: 497-14337-1-ND; Manufacturer Part Number: TSZ124IQ4T; RoHS: Compliant; Category: Amplifiers - Op Amps, Buffer, Instrumentation; Stock: 10565; Pricing: 1=1,86, 10=1,367, 25=1,2444, 100=1,1092, 250=1,0448, 500=1,00596, 1000=0,97398 (USD); Case/Package: QFN; China RoHS: Compliant; Gain Bandwidth Product: 400kHz; Height - Seated (Max): 1mm; Length: 3mm; Lifecycle Status: Production; Max Operating Temperature: 125°C; Min Operating Temperature: -40°C; Mounting Technology: Surface Mount; Number of Circuits: 4; Pins: 16; Number of Terminals: 4; Operating Supply Current: 31µA; Packaging: Tape and Reel; REACH SVHC: Yes; Schedule B: 8542330000, 8542330000|8542330000|8542330000|8542330000|8542330000; Terminal Pitch: 500µm; Unity Gain Bandwidth Product: 400kHz; Width: 3mm; ComponentLink1URL: https://datasheet.octopart.com:443/TSZ124IQ4T-STMicroelectronics-datasheet-62337710.pdf?src-supplier=Future+Electronics; ComponentLink1Description: https://datasheet.octopart.com:443/TSZ124IQ4T-STMicroelectronics-datasheet-62337710.pdf?src-supplier=Future+Electronics; ComponentLink2URL: https://datasheet.octopart.com:443/TSZ124IQ4T-STMicroelectronics-datasheet-16350222.pdf?src-supplier=STMicroelectronics; ComponentLink2Description: https://datasheet.octopart.com:443/TSZ124IQ4T-STMicroelectronics-datasheet-16350222.pdf?src-supplier=STMicroelectronics; ComponentLink3URL: https://datasheet.octopart.com:443/TSZ124IQ4T-STMicroelectronics-datasheet-140259870.pdf?src-supplier=Farnell; ComponentLink3Description: https://datasheet.octopart.com:443/TSZ124IQ4T-STMicroelectronics-datasheet-140259870.pdf?src-supplier=Farnell; ComponentLink4URL: https://datasheet.octopart.com:443/TSZ124IQ4T-STMicroelectronics-datasheet-159009515.pdf?src-supplier=SHENGYU+ELECTRONICS; ComponentLink4Description: https://datasheet.octopart.com:443/TSZ124IQ4T-STMicroelectronics-datasheet-159009515.pdf?src-supplier=SHENGYU+ELECTRONICS; ComponentLink5URL: https://datasheet.octopart.com:443/TSZ124IQ4T-STMicroelectronics-datasheet-165583692.pdf?src-supplier=TME; ComponentLink5Description: https://datasheet.octopart.com:443/TSZ124IQ4T-STMicroelectronics-datasheet-165583692.pdf?src-supplier=TME

## Sheet Supply.SchDoc: Title
size A4; Author: Adam Mizerkiewicz; CompanyName: Adam Mizerkiewicz; DrawnBy: Adam Mizerkiewicz; Engineer: Adam Mizerkiewicz; Organization: Adam Mizerkiewicz; Address1: Sarnia 2/19; Address2: 61-058 Poznań; Revision: 0.0; SheetNumber: 3; SheetTotal: 17
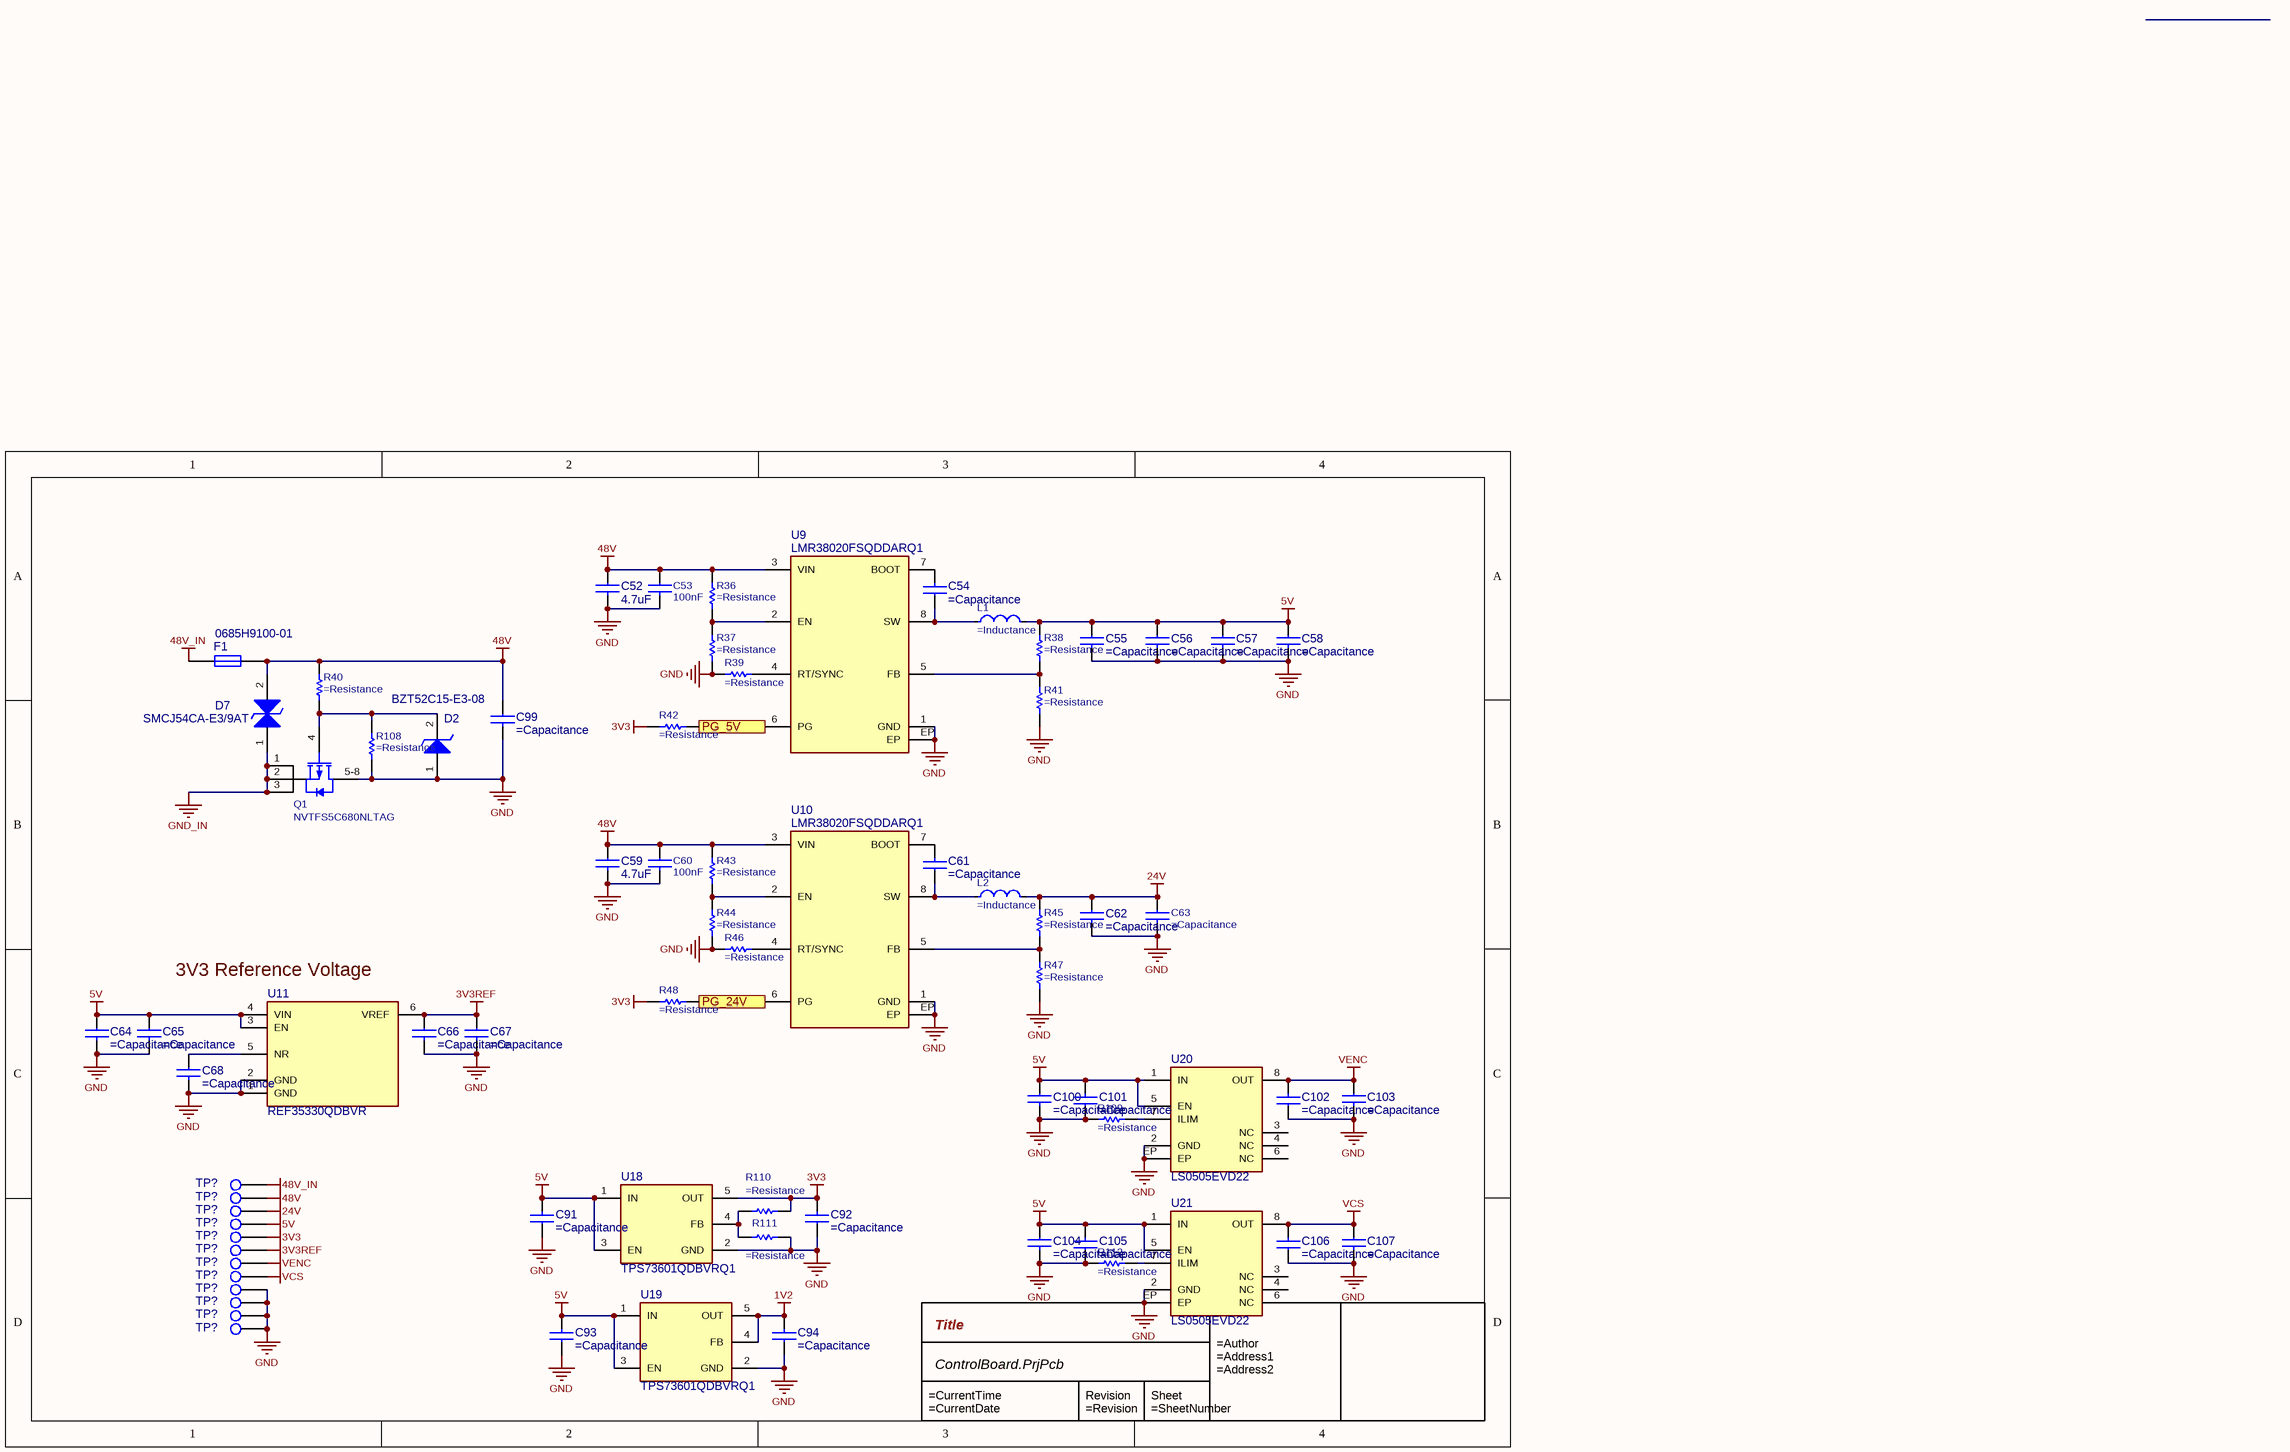
[diagram p13: Supply.SchDoc]

### Parts
(Parts that share a designator on the sheet are numbered #1, #2 ... from top to bottom, then left to right.)
C52  4.7uF  [C1206]
C53  100nF  [C0603]
C54  (no value)  [C0402]
C55  (no value)  [C0402]
C56  (no value)  [C0402]
C57  (no value)  [C0402]
C58  (no value)  [C0402]
C59  4.7uF  [C1206]
C60  100nF  [C0603]
C61  (no value)  [C0402]
C62  (no value)  [C0402]
C63  (no value)  [C0805]
C64  (no value)  [C0402]
C65  (no value)  [C0402]
C66  (no value)  [C0402]
C67  (no value)  [C0402]
C68  (no value)  [C0402]
C91  (no value)  [C0402]
C92  (no value)  [C0402]
C93  (no value)  [C0402]
C94  (no value)  [C0402]
C99  (no value)  [C1206]
C100  (no value)  [C0402]
C101  (no value)  [C0402]
C102  (no value)  [C0402]
C103  (no value)  [C0402]
C104  (no value)  [C0402]
C105  (no value)  [C0402]
C106  (no value)  [C0402]
C107  (no value)  [C0402]
D2  BZT52C15-E3-08  [SOD-123]
D7  SMCJ54CA-E3/9AT  [SMCJ_UNIPOLAR]
F1  0685H9100-01  [FUSE1206]
L1  (no value)  [ETQP4MxxxYFP]
L2  (no value)  [ETQP5MxxxYFM]
Q1  NVTFS5C680NLTAG  [WDFN8]
R36  (no value)  [R0402]
R37  (no value)  [R0402]
R38  (no value)  [R0402]
R39  (no value)  [R0402]
R40  (no value)  [R0402]
R41  (no value)  [R0402]
R42  (no value)  [R0402]
R43  (no value)  [R0402]
R44  (no value)  [R0402]
R45  (no value)  [R0402]
R46  (no value)  [R0402]
R47  (no value)  [R0402]
R48  (no value)  [R0402]
R108  (no value)  [R0402]
R109  (no value)  [R0402]
R110  (no value)  [R0402]
R111  (no value)  [R0402]
R112  (no value)  [R0402]
TP?#8  TP_SMT  [TP_SMT]  (value not drawn)  (no BOM)
TP?#9  TP_SMT  [TP_SMT]  (value not drawn)  (no BOM)
TP?#10  TP_SMT  [TP_SMT]  (value not drawn)  (no BOM)
TP?#11  TP_SMT  [TP_SMT]  (value not drawn)  (no BOM)
TP?#12  TP_SMT  [TP_SMT]  (value not drawn)  (no BOM)
TP?#13  TP_SMT  [TP_SMT]  (value not drawn)  (no BOM)
TP?#14  TP_SMT  [TP_SMT]  (value not drawn)  (no BOM)
TP?#15  TP_SMT  [TP_SMT]  (value not drawn)  (no BOM)
TP?#16  TP_SMT  [TP_SMT]  (value not drawn)  (no BOM)
TP?#17  TP_SMT  [TP_SMT]  (value not drawn)  (no BOM)
TP?#18  TP_SMT  [TP_SMT]  (value not drawn)  (no BOM)
TP?#19  TP_SMT  [TP_SMT]  (value not drawn)  (no BOM)
U9  LMR38020FSQDDARQ1  [SOIC8_PAD]
U10  LMR38020FSQDDARQ1  [SOIC8_PAD]
U11  REF35330QDBVR  [SOT-23-6]
U18  TPS73601QDBVRQ1  [SOT-23-5]
U19  TPS73601QDBVRQ1  [SOT-23-5]
U20  LS0505EVD22  [DFN2x2_8L]
U21  LS0505EVD22  [DFN2x2_8L]

### Ports
PG_5V (out), PG_24V (out)

### Nets
1V2: C94.2 U19.4(FB) U19.5(OUT)
3V3: C92.2 R42.2 R48.2 R110.2 TP?#12.1 U18.5(OUT)
3V3REF: C66.1 C67.1 TP?#13.1 U11.6(VREF)
5V: C55.1 C56.1 C57.1 C58.1 C64.1 C65.1 C91.2 C93.2 C100.1 C101.2 C104.1 C105.2 L1.2 R38.2 TP?#11.1 U11.3(EN) U11.4(VIN) U18.1(IN) U18.3(EN) U19.1(IN) U19.3(EN) U20.1(IN) U20.5(EN) U21.1(IN) U21.5(EN)
24V: C62.1 C63.1 L2.2 R45.2 TP?#10.1
48V: C52.1 C53.1 C59.1 C60.1 C99.1 D7.2 F1.1 R36.2 R40.2 R43.2 TP?#9.1 U9.3(VIN) U10.3(VIN)
48V_IN: F1.2 TP?#8.1
GND: C52.2 C53.2 C55.2 C56.2 C57.2 C58.2 C59.2 C60.2 C62.2 C63.2 C64.2 C65.2 C66.2 C67.2 C68.2 C91.1 C92.1 C93.1 C94.1 C99.2 C100.2 C101.1 C102.1 C103.2 C104.2 C105.1 C106.1 C107.2 D2.1 Q1.5-8(D) R37.1 R39.1 R41.1 R44.1 R46.1 R47.1 R108.1 R109.1 R111.2 R112.1 TP?#16.1 TP?#17.1 TP?#18.1 TP?#19.1 U9.1(GND) U9.EP U10.1(GND) U10.EP U11.1(GND) U11.2(GND) U18.2(GND) U19.2(GND) U20.2(GND) U20.EP U21.2(GND) U21.EP
GND_IN: D7.1 Q1.1(S) Q1.2(S) Q1.3(S)
VCS: C106.2 C107.1 TP?#15.1 U21.8(OUT)
VENC: C102.2 C103.1 TP?#14.1 U20.8(OUT)
PG_24V: R48.1 U10.6(PG) ; port PG_24V
PG_ 5V: R42.1 U9.6(PG) ; port PG_5V
NetC54_1: C54.1 L1.1 U9.8(SW)
NetC54_2: C54.2 U9.7(BOOT)
NetC61_1: C61.1 L2.1 U10.8(SW)
NetC61_2: C61.2 U10.7(BOOT)
NetC68_1: C68.1 U11.5(NR)
NetD2_2: D2.2 Q1.4(G) R40.1 R108.2
NetR36_1: R36.1 R37.2 U9.2(EN)
NetR38_1: R38.1 R41.2 U9.5(FB)
NetR39_2: R39.2 U9.4(RT/SYNC)
NetR43_1: R43.1 R44.2 U10.2(EN)
NetR45_1: R45.1 R47.2 U10.5(FB)
NetR46_2: R46.2 U10.4(RT/SYNC)
NetR109_2: R109.2 U20.7(ILIM)
NetR110_1: R110.1 R111.1 U18.4(FB)
NetR112_2: R112.2 U21.7(ILIM)

Not connected (* = marked no-connect by the designer): U20 3(NC) 4(NC) 6(NC); U21 3(NC) 4(NC) 6(NC)

### Notes on the sheet
- 3V3 Reference Voltage
- Revision
  =Revision
- Sheet
  =SheetNumber / =SheetTotal